# Altium project CC3200 PCB_V1.0_Project.PrjPcb
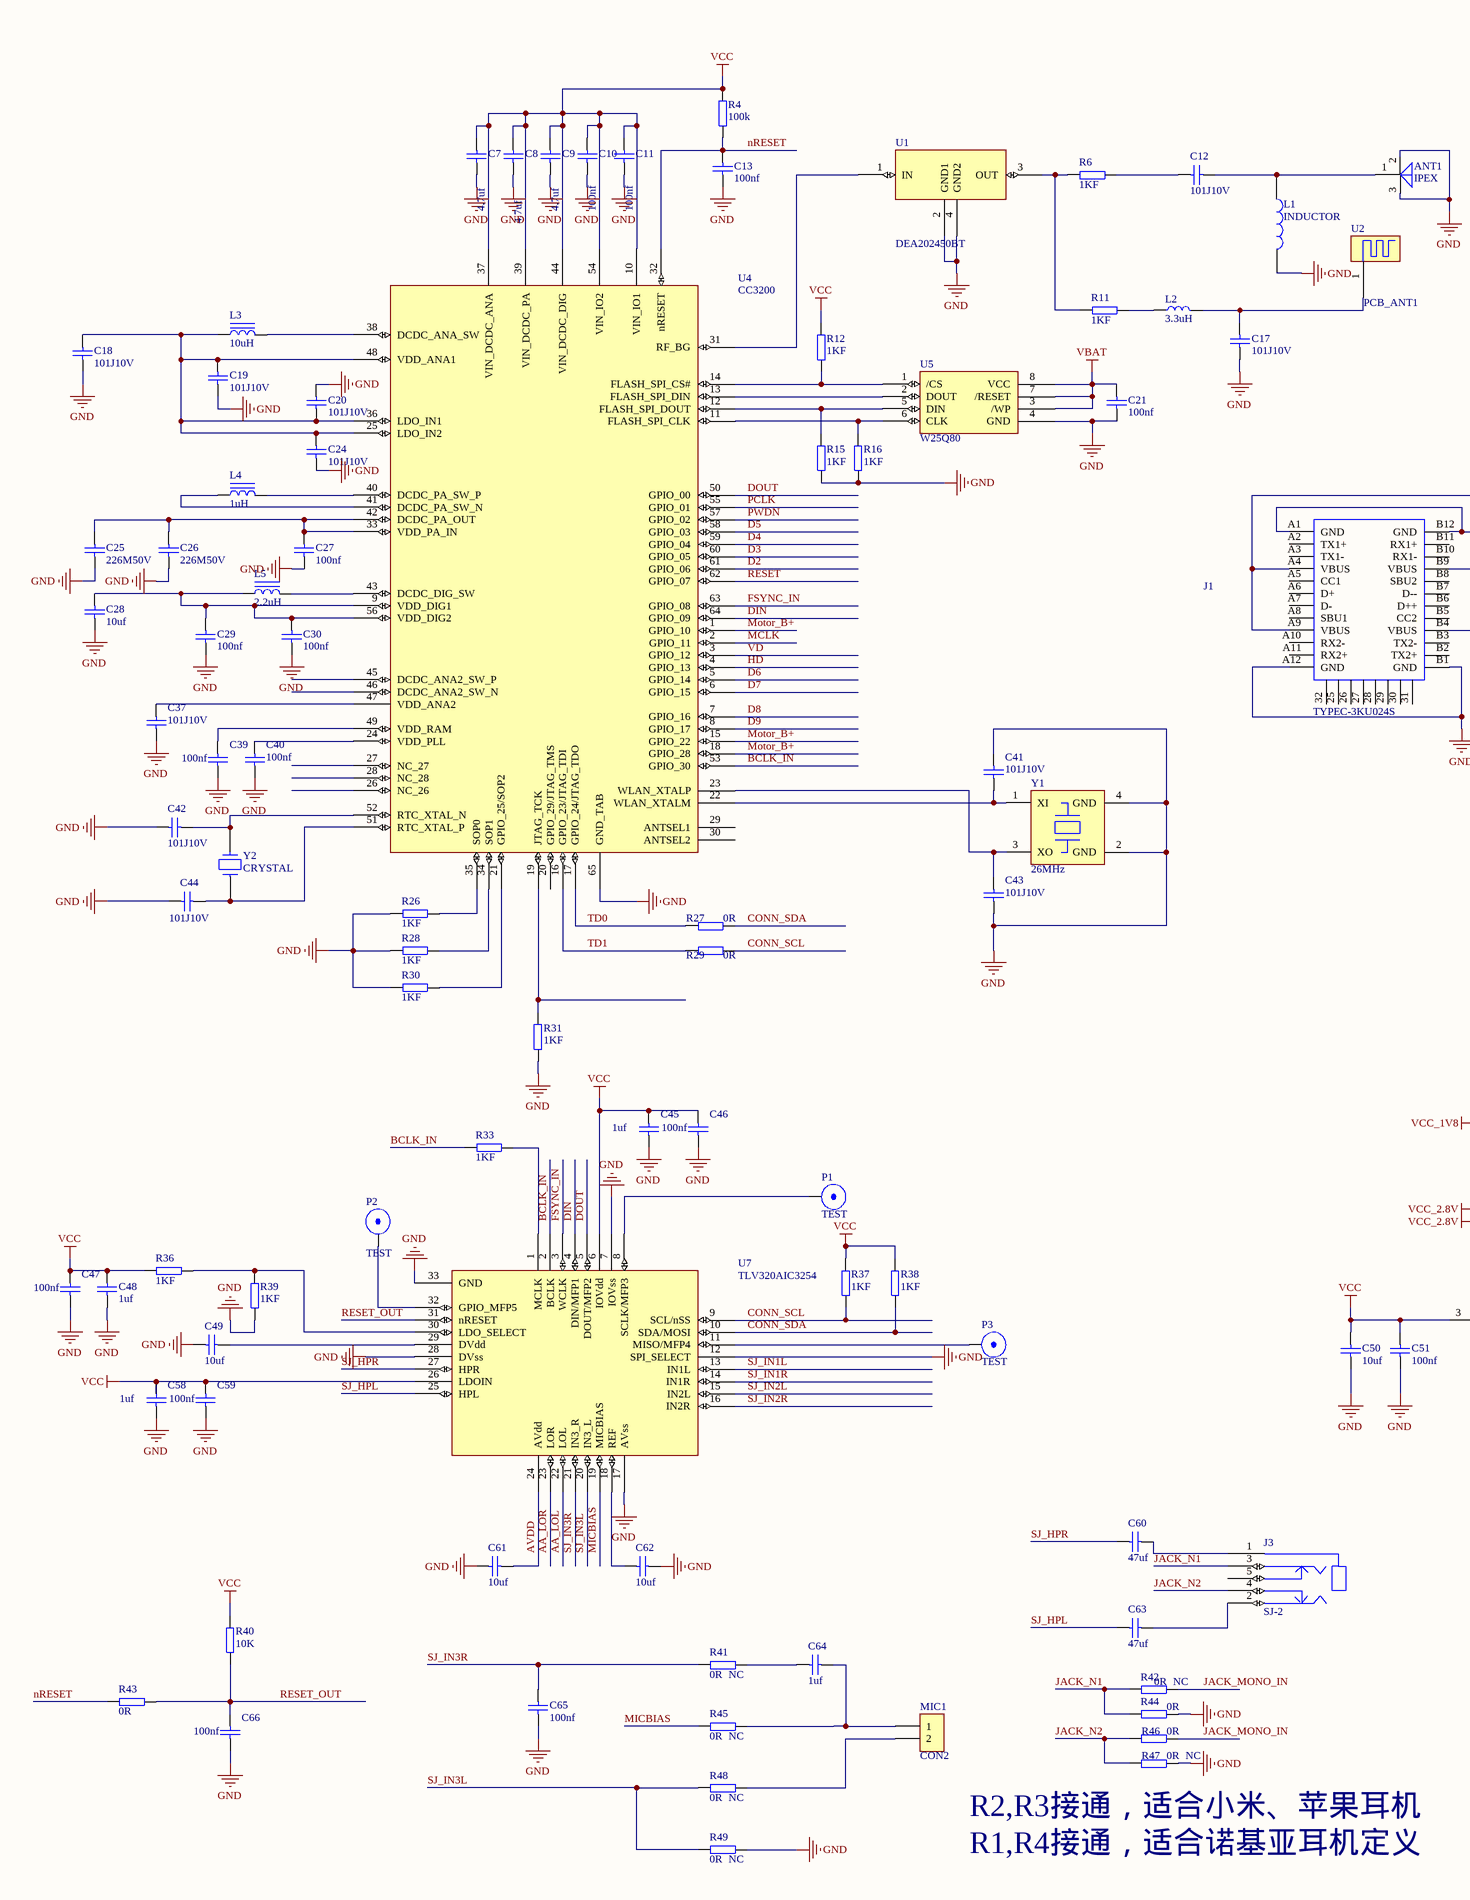
[diagram p0: CC3200 SCH.SchDoc, left]
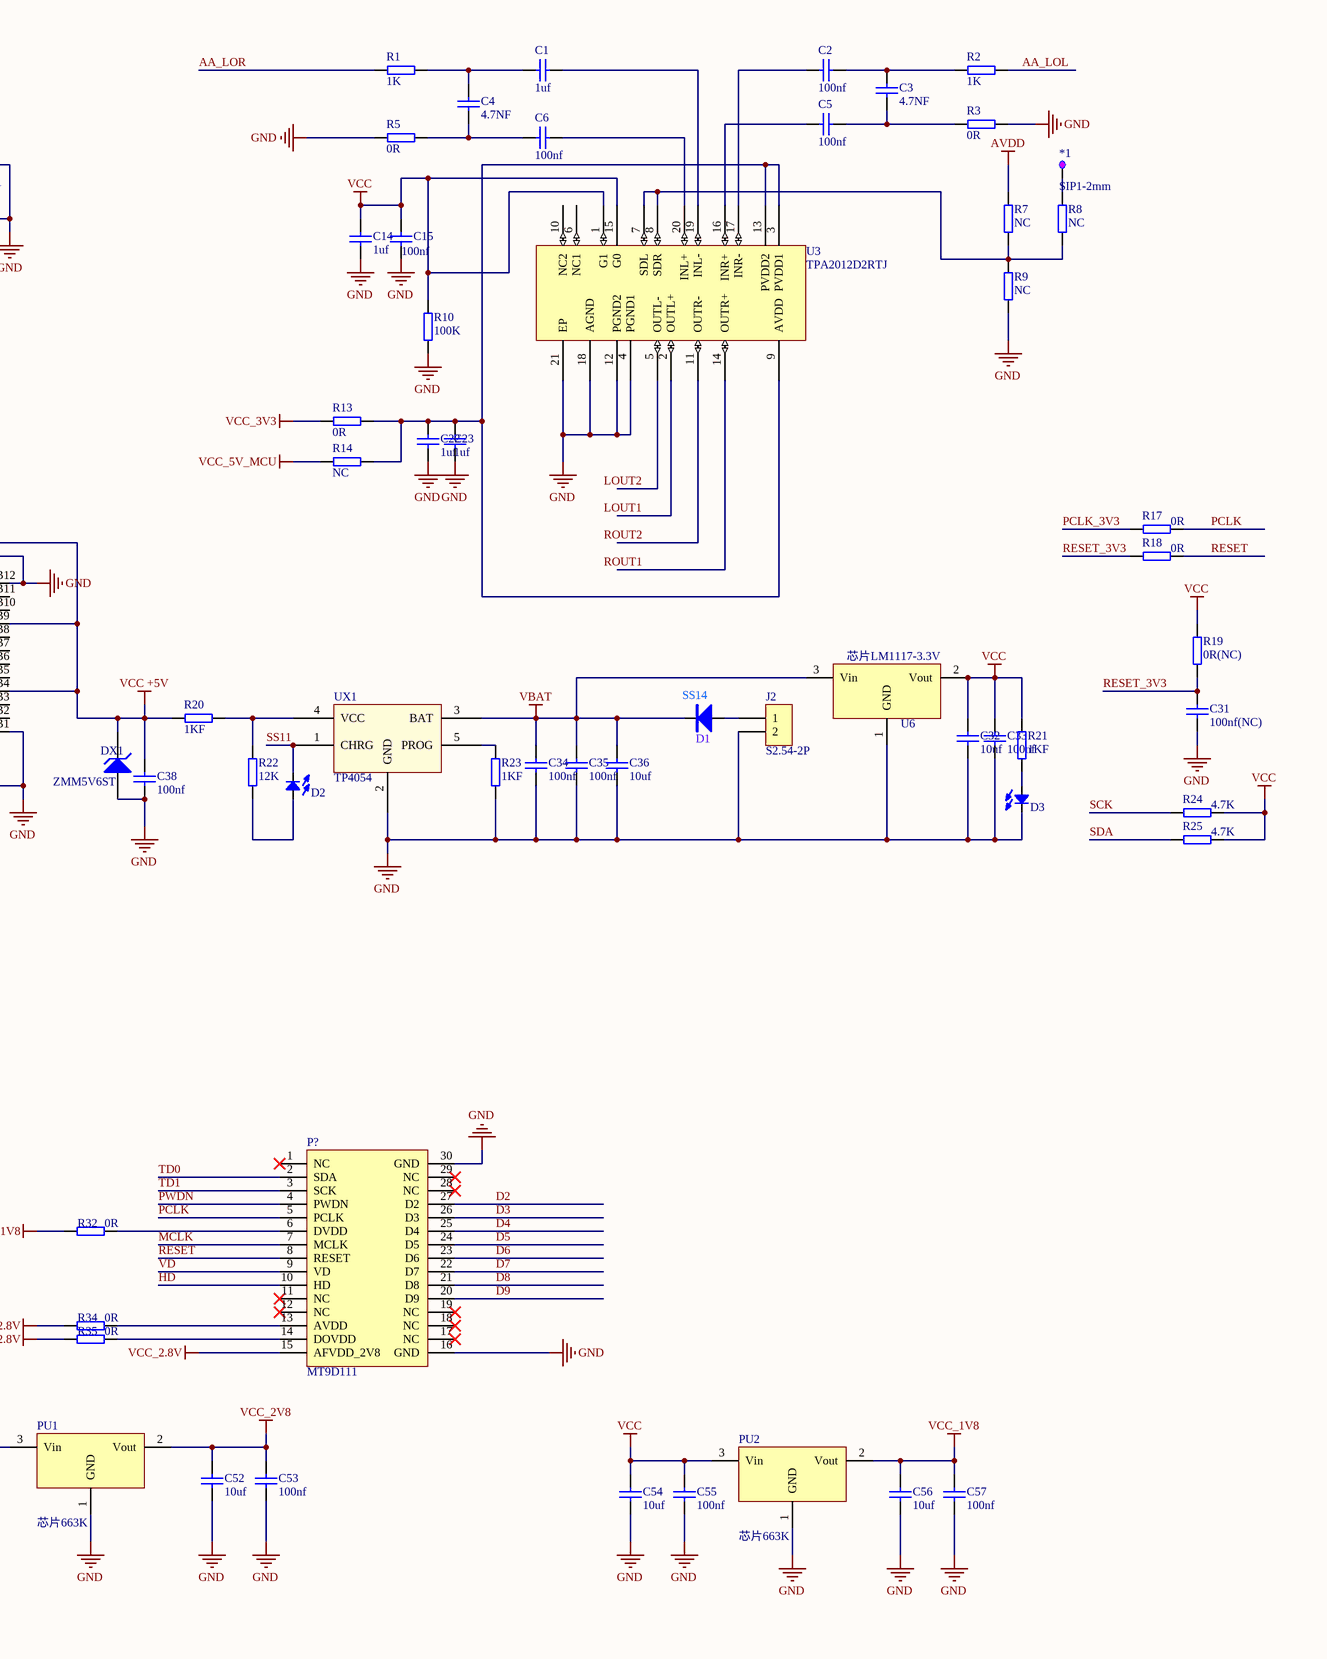
[diagram p1: CC3200 SCH.SchDoc, right]
1 sheet, 145 parts. Net scope: global (net labels, ports and power ports of the same name join across sheets).
Board file: CC3200.PcbDoc

## Sheet CC3200 SCH.SchDoc
size A2

### Parts
*1  SIP1-2mm  [SIP1-2mm]
ANT1  IPEX  [J-IPEX]
C1  1uf  [C0402]
C2  100nf  [C0402]
C3  4.7NF  [C0402]
C4  4.7NF  [C0402]
C5  100nf  [C0402]
C6  100nf  [C0402]
C7  4.7uf  [C0603]
C8  4.7uf  [C0603]
C9  4.7uf  [C0603]
C10  100nf  [C0402]
C11  100nf  [C0402]
C12  101J10V  [C0402]
C13  100nf  [C0402]
C14  1uf  [C0402]
C15  100nf  [C0402]
C17  101J10V  [C0402]
C18  101J10V  [C0402]
C19  101J10V  [C0402]
C20  101J10V  [C0402]
C21  100nf  [C0402]
C22  1uf  [C0402]
C23  1uf  [C0402]
C24  101J10V  [C0402]
C25  226M50V  [C0805]
C26  226M50V  [C0805]
C27  100nf  [C0402]
C28  10uf  [C0603]
C29  100nf  [C0402]
C30  100nf  [C0402]
C31  100nf(NC)  [C0402]
C32  10uf  [C0603]
C33  100nf  [C0402]
C34  100nf  [C0402]
C35  100nf  [C0402]
C36  10uf  [C0603]
C37  101J10V  [C0402]
C38  100nf  [C0402]
C39  100nf  [C0402]
C40  100nf  [C0402]
C41  101J10V  [C0402]
C42  101J10V  [C0402]
C43  101J10V  [C0402]
C44  101J10V  [C0402]
C45  1uf  [C0402]
C46  100nf  [C0402]
C47  100nf  [C0402]
C48  1uf  [C0402]
C49  10uf  [C0603]
C50  10uf  [C0603]
C51  100nf  [C0402]
C52  10uf  [C0603]
C53  100nf  [C0402]
C54  10uf  [C0603]
C55  100nf  [C0402]
C56  10uf  [C0603]
C57  100nf  [C0402]
C58  1uf  [C0402]
C59  100nf  [C0402]
C60  47uf  [C0603]
C61  10uf  [C0603]
C62  10uf  [C0603]
C63  47uf  [C0603]
C64  1uf  [C0402]
C65  100nf  [C0402]
C66  100nf  [C0402]
D1  SS14  [SMA]
D2  发光二极管  [0603D]  (value not drawn)
D3  发光二极管  [0603D]  (value not drawn)
DX1  ZMM5V6ST  [1206A]
J1  TYPEC-3KU024S  [MICRO -TYPE C]
J2  S2.54-2P  [S2.54-2P]
J3  SJ-2  [PJ-393-8P]
L1  INDUCTOR  [0402_SMALL]
L2  3.3uH
L3  10uH  [LI-0608]
L4  1uH  [LI-0608]
L5  2.2uH  [LI-0608]
MIC1  CON2  [MIC-6MM]
P1  TEST  [TP]
P2  TEST  [TP]
P3  TEST  [TP]
P?  MT9D111  [MT9D111_A]
PU1  芯片663K  [SOT23]
PU2  芯片663K  [SOT23]
R1  1K  [R0402]
R2  1K  [R0402]
R3  0R  [R0402]
R4  100k  [R0402]
R5  0R  [R0402]
R6  1KF  [R0402]
R7  NC  [R0402]
R8  NC  [R0402]
R9  NC  [R0402]
R10  100K  [R0402]
R11  1KF  [R0402]
R12  1KF  [R0402]
R13  0R  [R0402]
R14  NC  [R0402]
R15  1KF  [R0402]
R16  1KF  [R0402]
R17  0R  [R0402]
R18  0R  [R0402]
R19  0R(NC)  [R0402]
R20  1KF  [R0402]
R21  1KF  [R0402]
R22  12K  [R0402]
R23  1KF  [R0402]
R24  4.7K  [R0402]
R25  4.7K  [R0402]
R26  1KF  [R0402]
R27  0R  [R0402]
R28  1KF  [R0402]
R29  0R  [R0402]
R30  1KF  [R0402]
R31  1KF  [R0402]
R32  0R  [R0402]
R33  1KF  [R0402]
R34  0R  [R0402]
R35  0R  [R0402]
R36  1KF  [R0402]
R37  1KF  [R0402]
R38  1KF  [R0402]
R39  1KF  [R0402]
R40  10K  [R0402]
R41  0R  NC  [R0402]
R42  0R  NC  [R0402]
R43  0R  [R0402]
R44  0R  [R0402]
R45  0R  NC  [R0402]
R46  0R  [R0402]
R47  0R  NC  [R0402]
R48  0R  NC  [R0402]
R49  0R  NC  [R0402]
U1  DEA202450BT  [DEA202450BT]
U2  PCB_ANT1  [BLE-ANT1]
U3  TPA2012D2RTJ  [TPA2012D2RTJ]
U4  CC3200  [CC3200]
U5  W25Q80  [SO-8S]
U6  芯片LM1117-3.3V  [SOT223S]
U7  TLV320AIC3254  [TLV320AIC3254]
UX1  TP4054  [SOT23-5]
Y1  26MHz  [Y-CPX-32GA-4P]
Y2  CRYSTAL

### Nets
AVDD: C61.2 R7.2 U7.24(AVdd)
GND: ANT1.2 ANT1.3 C7.2 C8.2 C9.1 C10.2 C11.2 C13.2 C14.1 C15.1 C17.2 C18.2 C19.2 C20.1 C21.2 C22.1 C23.1 C24.2 C25.2 C26.1 C27.2 C28.2 C29.2 C30.2 C31.2 C32.2 C33.2 C34.2 C35.2 C36.2 C37.2 C38.2 C39.2 C40.2 C41.1 C42.1 C43.2 C44.1 C45.2 C46.2 C47.2 C48.2 C49.2 C50.1 C51.1 C52.1 C53.1 C54.1 C55.1 C56.1 C57.1 C58.2 C59.2 C61.1 C62.2 C65.1 C66.2 D3.K DX1.1(A) J1.A1(GND) J1.A12(GND) J1.B1(GND) J1.B12(GND) J2.2 L1.2 P?.16(GND) P?.30(GND) PU1.1(GND) PU2.1(GND) R3.2 R5.1 R9.1 R10.1 R15.1 R16.1 R23.1 R26.1 R28.1 R30.1 R31.1 R39.1 R44.2 R47.2 R49.2 U1.2(GND1) U1.4(GND2) U3.4(PGND1) U3.12(PGND2) U3.18(AGND) U3.21(EP) U4.65(GND_TAB) U5.4(GND) U6.1(GND) U7.7(IOVss) U7.12(SPI_SELECT) U7.17(AVss) U7.28(DVss) U7.33(GND) UX1.2(GND) Y1.2(GND) Y1.4(GND)
VBAT: C21.1 C34.1 C35.1 C36.1 D1.K U5.3(/WP) U5.7(/RESET) U5.8(VCC) U6.3(Vin) UX1.3(BAT)
VCC: C7.1 C8.1 C9.2 C10.1 C11.1 C14.2 C15.2 C32.1 C33.1 C45.1 C46.1 C47.1 C48.1 C50.2 C51.2 C54.2 C55.2 C58.1 C59.1 PU1.3(Vin) PU2.3(Vin) R4.2 R10.2 R12.2 R19.2 R21.2 R24.1 R25.1 R36.1 R37.2 R38.2 R40.2 U3.1(G1) U3.15(G0) U4.10(VIN_IO1) U4.37(VIN_DCDC_ANA) U4.39(VIN_DCDC_PA) U4.44(VIN_DCDC_DIG) U4.54(VIN_IO2) U6.2(Vout) U7.6(IOVdd) U7.26(LDOIN)
VCC +5V: C38.1 DX1.2(K) J1.A4(VBUS) J1.A9(VBUS) J1.B4(VBUS) J1.B9(VBUS) R20.2
VCC_1V8: C56.2 C57.2 PU2.2(Vout) R32.1
VCC_2.8V: P?.15(AFVDD_2V8) R34.1 R35.1
VCC_2V8: C52.2 C53.2 PU1.2(Vout)
VCC_3V3: R13.1
VCC_5V_MCU: R14.1
AA_LOL: R2.2 U7.22(LOL)
AA_LOR: R1.1 U7.23(LOR)
BCLK_IN: R33.1 U4.53(GPIO_30) U7.2(BCLK)
CONN_SCL: R29.2 R37.1 U7.9(SCL/nSS)
CONN_SDA: R27.2 R38.1 U7.10(SDA/MOSI)
D2: P?.27(D2) U4.61(GPIO_06)
D3: P?.26(D3) U4.60(GPIO_05)
D4: P?.25(D4) U4.59(GPIO_04)
D5: P?.24(D5) U4.58(GPIO_03)
D6: P?.23(D6) U4.5(GPIO_14)
D7: P?.22(D7) U4.6(GPIO_15)
D8: P?.21(D8) U4.7(GPIO_16)
D9: P?.20(D9) U4.8(GPIO_17)
DIN: U4.64(GPIO_09) U7.4(DIN/MFP1)
DOUT: U4.50(GPIO_00) U7.5(DOUT/MFP2)
FSYNC_IN: U4.63(GPIO_08) U7.3(WCLK)
HD: P?.10(HD) U4.4(GPIO_13)
JACK_MONO_IN: R42.2 R46.2
JACK_N1: J3.3 R42.1 R44.1
JACK_N2: J3.4 R46.1 R47.1
MCLK: P?.7(MCLK) U4.2(GPIO_11)
MICBIAS: R45.1 U7.19(MICBIAS)
Motor_B+: U4.1(GPIO_10) U4.15(GPIO_22) U4.18(GPIO_28)
nRESET: C13.1 R4.1 R43.1 U4.32(nRESET)
PCLK: P?.5(PCLK) R17.1 U4.55(GPIO_01)
PCLK_3V3: R17.2
PWDN: P?.4(PWDN) U4.57(GPIO_02)
RESET: P?.8(RESET) R18.1 U4.62(GPIO_07)
RESET_3V3: C31.1 R18.2 R19.1
RESET_OUT: C66.1 R40.1 R43.2 U7.31(nRESET)
SCK: R24.2
SDA: R25.2
SJ_HPL: C63.1 U7.25(HPL)
SJ_HPR: C60.1 U7.27(HPR)
SJ_IN1L: U7.13(IN1L)
SJ_IN1R: U7.14(IN1R)
SJ_IN2L: U7.15(IN2L)
SJ_IN2R: U7.16(IN2R)
SJ_IN3L: R48.1 R49.1 U7.20(IN3_L)
SJ_IN3R: C65.2 R41.1 U7.21(IN3_R)
SS11: D2.K UX1.1(CHRG)
TD0: P?.2(SDA) R27.1 U4.17(GPIO_24/JTAG_TDO)
TD1: P?.3(SCK) R29.1 U4.16(GPIO_23/JTAG_TDI)
VD: P?.9(VD) U4.3(GPIO_12)
Net*1_1: *1.1 R8.2
NetANT1_1: ANT1.1(W) C12.2 L1.1
NetC1_1: C1.1 C4.2 R1.2
NetC1_2: C1.2 U3.19(INL-)
NetC2_1: C2.1 U3.17(INR-)
NetC2_2: C2.2 C3.2 R2.1
NetC3_1: C3.1 C5.2 R3.1
NetC4_1: C4.1 C6.1 R5.2
NetC5_1: C5.1 U3.16(INR+)
NetC6_2: C6.2 U3.20(INL+)
NetC12_1: C12.1 R6.2
NetC17_1: C17.1 L2.2 U2.1
NetC18_1: C18.1 C19.1 C20.2 C24.1 L3.1 U4.25(LDO_IN2) U4.36(LDO_IN1) U4.48(VDD_ANA1)
NetC22_2: C22.2 C23.2 R13.2 R14.2 U3.3(PVDD1) U3.9(AVDD) U3.13(PVDD2)
NetC25_1: C25.1 C26.2 C27.1 U4.33(VDD_PA_IN) U4.42(DCDC_PA_OUT)
NetC28_1: C28.1 C29.1 C30.1 L5.1 U4.9(VDD_DIG1) U4.56(VDD_DIG2)
NetC37_1: C37.1 U4.47(VDD_ANA2)
NetC39_1: C39.1 U4.49(VDD_RAM)
NetC40_1: C40.1 U4.24(VDD_PLL)
NetC41_2: C41.2 U4.22(WLAN_XTALM) Y1.1(XI)
NetC42_2: C42.2 U4.52(RTC_XTAL_N) Y2.2
NetC43_1: C43.1 U4.23(WLAN_XTALP) Y1.3(XO)
NetC44_2: C44.2 U4.51(RTC_XTAL_P) Y2.1
NetC49_1: C49.1 U7.29(DVdd)
NetC60_2: C60.2 J3.1
NetC62_1: C62.1 U7.18(REF)
NetC63_2: C63.2 J3.2
NetC64_1: C64.1 R41.2
NetC64_2: C64.2 MIC1.1 R45.2
NetD1_A: D1.A J2.1
NetD2_A: D2.A R22.1
NetD3_A: D3.A R21.1
NetL2_1: L2.1 R11.2
NetL3_2: L3.2 U4.38(DCDC_ANA_SW)
NetL4_1: L4.1 U4.41(DCDC_PA_SW_N)
NetL4_2: L4.2 U4.40(DCDC_PA_SW_P)
NetL5_2: L5.2 U4.43(DCDC_DIG_SW)
NetMIC1_2: MIC1.2 R48.2
NetP1_1: P1.1(Y1) U7.8(SCLK/MFP3)
NetP2_1: P2.1(Y1) U7.32(GPIO_MFP5)
NetP3_1: P3.1(Y1) U7.11(MISO/MFP4)
NetP?_6: P?.6(DVDD) R32.2
NetP?_13: P?.13(AVDD) R34.2
NetP?_14: P?.14(DOVDD) R35.2
NetR6_1: R6.1 R11.1 U1.3(OUT)
NetR7_1: R7.1 R8.1 R9.2 U3.7(SDL) U3.8(SDR)
NetR12_1: R12.1 U4.14(FLASH_SPI_CS#) U5.1(/CS)
NetR15_2: R15.2 U4.12(FLASH_SPI_DOUT) U5.5(DIN)
NetR16_2: R16.2 U4.11(FLASH_SPI_CLK) U5.6(CLK)
NetR20_1: R20.1 R22.2 UX1.4(VCC)
NetR23_2: R23.2 UX1.5(PROG)
NetR26_2: R26.2 U4.35(SOP0)
NetR28_2: R28.2 U4.34(SOP1)
NetR30_2: R30.2 U4.21(GPIO_25/SOP2)
NetR31_2: R31.2 U4.19(JTAG_TCK)
NetR33_2: R33.2 U7.1(MCLK)
NetR36_2: R36.2 R39.2 U7.30(LDO_SELECT)
NetU1_1: U1.1(IN) U4.31(RF_BG)
NetU4_13: U4.13(FLASH_SPI_DIN) U5.2(DOUT)

Not connected (* = marked no-connect by the designer): J1 25 26(B13) 27(B14) 28(B15) 29(B16) 30(B17) 31(B18) 32(B13) A2(TX1+) A3(TX1-) A5(CC1) A6(D+) A7(D-) A8(SBU1) A10(RX2-) A11(RX2+) B2(TX2+) B3(TX2-) B5(CC2) B6(D++) B7(D--) B8(SBU2) B10(RX1-) B11(RX1+); J3 5; P? 1(NC)* 11(NC)* 12(NC)* 17(NC)* 18(NC)* 19(NC)* 28(NC)* 29(NC)*; U3 2(OUTL+) 5(OUTL-) 6(NC1) 10(NC2) 11(OUTR-) 14(OUTR+); U4 20(GPIO_29/JTAG_TMS) 26(NC_26) 27(NC_27) 28(NC_28) 29(ANTSEL1) 30(ANTSEL2) 45(DCDC_ANA2_SW_P) 46(DCDC_ANA2_SW_N)

### Notes on the sheet
- (near R47) R2,R3接通，适合小米、苹果耳机
- R1,R4接通，适合诺基亚耳机定义
- Labels drawn without touching a wire or pin: LOUT1, LOUT2, ROUT1, ROUT2

### Library data of the parts
ANT1 = J-IPEX
C1-C6 C10-C15 C17-C24 C27 C29-C31 C33-C35 C37-C48 C51 C53 C55 C57-C59 C64-C66 = C0402X7R-101J10V: 贴片电容-陶瓷; 规格型号: 100pF±5%_10V_X7R_C0402; 生产商: 风华 三星; 供应商: *; 备注: *
C7-C9 = C0603X7R-475K16V: 贴片电容-陶瓷; 规格型号: 4.7uF±10%_16V_X7R_C0603; 生产商: 风华 三星; 供应商: *; 备注: *
C25 C26 = C0805Y5V-226M50V: 贴片电容-陶瓷; 规格型号: 22uF±20%_50V_Y5V_C0805; 生产商: 风华 三星; 供应商: *; 备注: *
C28 C32 C36 C49 C50 C52 C54 C56 C60-C63 = C0603X7R-106K50V: 贴片电容-陶瓷; 规格型号: 10uF±10%_50V_X7R_C0603; 生产商: 风华 三星; 供应商: *; 备注: *
D1 = SS14 DO-214: 二极管; 物料代码: 2.01.05.008
DX1 = D Zener: Zener Diode; Published: *; LatestRevisionDate: *; LatestRevisionNote: *; PackageReference: *; Publisher: *
J1 = TYPEC-3KU024S: DIP Switch; Published: 24-Mar-1999; LatestRevisionDate: 17-Jul-2002; LatestRevisionNote: Re-released for DXP Platform.; PackageReference: DIP-18; Publisher: Altium Limited; Code_JEDEC: MO-036-AE
J2 = J-S2.54-2P: 单排排针-直针; 货品编码: 372013; 供应商: *; 规格型号: S2.54-2P; 备注: *
L2 = 3.3uH: 贴片电感-屏蔽; 生产商: *; 供应商: *; 备注: *
L3-L5 = LI-0608-10uH1A: 插件电感-工形; 货品编码: 无样品无编码; 生产商: *; 规格型号: LI-0608-10uH1A; 供应商: *; 备注: *
MIC1 = CON2: Connector
P1-P3 = TEST: BNC Elbow Connector; LatestRevisionDate: 17-Jul-2002; LatestRevisionNote: Re-released for DXP Platform.; Publisher: Altium Limited
PU1 PU2 = 663K
R1-R49 = R0402-1KF: 贴片电阻-通用; 生产商: 厚声 国巨; 规格型号: 1K±1%_1/10W_±200ppm_R0402; 备注: *; 供应商: *
U6 = AS1117
Y1 = YC-26MHz: 晶振-贴片无源; 规格型号: 26MHz_贴片晶振3225; 货品编码: 无样品无编码; 生产商: *; 供应商: *; 备注: *